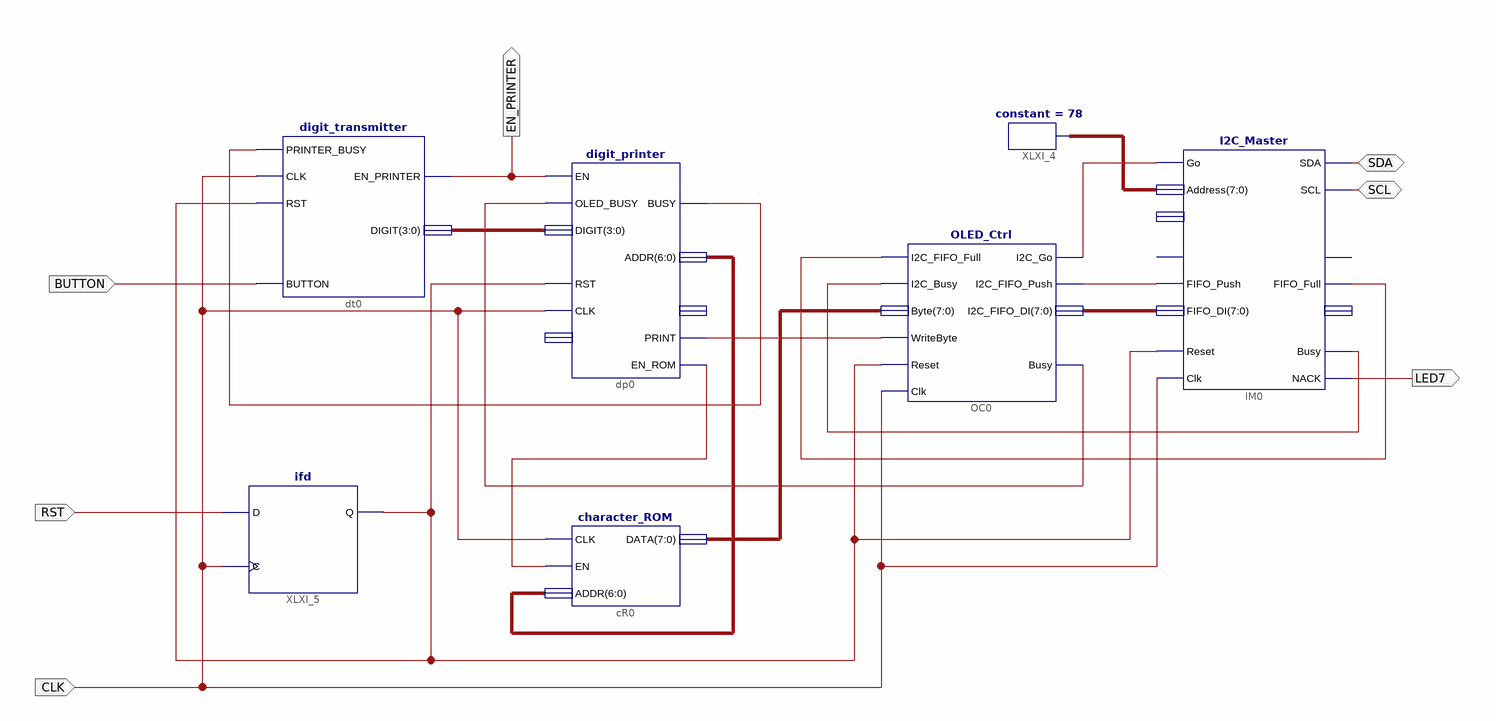
[diagram p0: schematic sheet 1]
// Xilinx ISE schematic OLED_display.sch (spartan3e) as structural Verilog: 7 symbols, 7 ports
module OLED_display (
  input  CLK,
  input  RST,
  input  BUTTON,
  inout  SDA,
  inout  SCL,
  output LED7,
  output EN_PRINTER
);

  wire EN_ROM, I2C_BUSY, I2C_FIFO_FULL, I2C_FIFO_PUSH, I2C_GO, OLED_BUSY, PRINT, PRINTER_BUSY, RST1;
  wire [3:0] DIGIT;
  wire [6:0] ADDR;
  wire [7:0] I2C_FIFO_DI, XLXN_18, XLXN_20;

  I2C_Master IM0 (
    .Clk(CLK), .Reset(RST1), .Go(I2C_GO), .FIFO_Push(I2C_FIFO_PUSH), .Address(XLXN_18),
    .FIFO_DI(I2C_FIFO_DI), .SDA(SDA), .SCL(SCL), .NACK(LED7), .Busy(I2C_BUSY), .FIFO_Full(I2C_FIFO_FULL));  // open: FIFO_Pop, ReadCnt, FIFO_Empty, FIFO_DO
  OLED_Ctrl OC0 (
    .Clk(CLK), .Reset(RST1), .WriteByte(PRINT), .I2C_FIFO_Full(I2C_FIFO_FULL), .I2C_Busy(I2C_BUSY),
    .Byte(XLXN_20), .Busy(OLED_BUSY), .I2C_Go(I2C_GO), .I2C_FIFO_Push(I2C_FIFO_PUSH),
    .I2C_FIFO_DI(I2C_FIFO_DI));
  constant #(.CValue("78")) XLXI_4 (.O(XLXN_18));
  character_ROM cR0 (.CLK(CLK), .EN(EN_ROM), .ADDR(ADDR), .DATA(XLXN_20));
  digit_transmitter dt0 (
    .PRINTER_BUSY(PRINTER_BUSY), .CLK(CLK), .RST(RST1), .BUTTON(BUTTON), .EN_PRINTER(EN_PRINTER),
    .DIGIT(DIGIT));
  digit_printer dp0 (
    .EN(EN_PRINTER), .OLED_BUSY(OLED_BUSY), .RST(RST1), .CLK(CLK), .DIGIT(DIGIT), .PRINT(PRINT),
    .BUSY(PRINTER_BUSY), .EN_ROM(EN_ROM), .ADDR(ADDR));  // open: DATA_IN, DATA_OUT
  ifd XLXI_5 (.C(CLK), .D(RST), .Q(RST1));
endmodule
